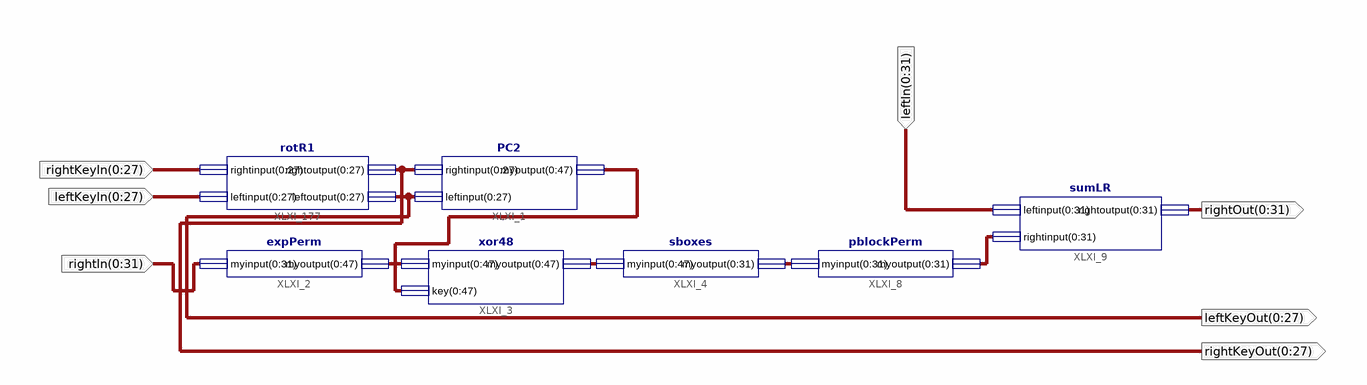
[diagram p0: schematic sheet 1]
// Xilinx ISE schematic decr_roundRot1.sch (spartan3e) as structural Verilog: 7 symbols, 7 ports
module decr_roundRot1 (
  input  [0:31] leftIn,
  input  [0:27] rightKeyIn,
  input  [0:27] leftKeyIn,
  input  [0:31] rightIn,
  output [0:27] leftKeyOut,
  output [0:27] rightKeyOut,
  output [0:31] rightOut
);

  wire [31:0] XLXN_19, XLXN_20;
  wire [47:0] XLXN_12, XLXN_18, XLXN_40;

  PC2 XLXI_1 (
    .rightinput(rightKeyOut), .leftinput(leftKeyOut),
    .myoutput({XLXN_40[0], XLXN_40[1], XLXN_40[2], XLXN_40[3], XLXN_40[4], XLXN_40[5], XLXN_40[6], XLXN_40[7], XLXN_40[8], XLXN_40[9], XLXN_40[10], XLXN_40[11], XLXN_40[12], XLXN_40[13], XLXN_40[14], XLXN_40[15], XLXN_40[16], XLXN_40[17], XLXN_40[18], XLXN_40[19], XLXN_40[20], XLXN_40[21], XLXN_40[22], XLXN_40[23], XLXN_40[24], XLXN_40[25], XLXN_40[26], XLXN_40[27], XLXN_40[28], XLXN_40[29], XLXN_40[30], XLXN_40[31], XLXN_40[32], XLXN_40[33], XLXN_40[34], XLXN_40[35], XLXN_40[36], XLXN_40[37], XLXN_40[38], XLXN_40[39], XLXN_40[40], XLXN_40[41], XLXN_40[42], XLXN_40[43], XLXN_40[44], XLXN_40[45], XLXN_40[46], XLXN_40[47]}));
  expPerm XLXI_2 (
    .myinput(rightIn),
    .myoutput({XLXN_12[0], XLXN_12[1], XLXN_12[2], XLXN_12[3], XLXN_12[4], XLXN_12[5], XLXN_12[6], XLXN_12[7], XLXN_12[8], XLXN_12[9], XLXN_12[10], XLXN_12[11], XLXN_12[12], XLXN_12[13], XLXN_12[14], XLXN_12[15], XLXN_12[16], XLXN_12[17], XLXN_12[18], XLXN_12[19], XLXN_12[20], XLXN_12[21], XLXN_12[22], XLXN_12[23], XLXN_12[24], XLXN_12[25], XLXN_12[26], XLXN_12[27], XLXN_12[28], XLXN_12[29], XLXN_12[30], XLXN_12[31], XLXN_12[32], XLXN_12[33], XLXN_12[34], XLXN_12[35], XLXN_12[36], XLXN_12[37], XLXN_12[38], XLXN_12[39], XLXN_12[40], XLXN_12[41], XLXN_12[42], XLXN_12[43], XLXN_12[44], XLXN_12[45], XLXN_12[46], XLXN_12[47]}));
  xor48 XLXI_3 (
    .myinput({XLXN_12[0], XLXN_12[1], XLXN_12[2], XLXN_12[3], XLXN_12[4], XLXN_12[5], XLXN_12[6], XLXN_12[7], XLXN_12[8], XLXN_12[9], XLXN_12[10], XLXN_12[11], XLXN_12[12], XLXN_12[13], XLXN_12[14], XLXN_12[15], XLXN_12[16], XLXN_12[17], XLXN_12[18], XLXN_12[19], XLXN_12[20], XLXN_12[21], XLXN_12[22], XLXN_12[23], XLXN_12[24], XLXN_12[25], XLXN_12[26], XLXN_12[27], XLXN_12[28], XLXN_12[29], XLXN_12[30], XLXN_12[31], XLXN_12[32], XLXN_12[33], XLXN_12[34], XLXN_12[35], XLXN_12[36], XLXN_12[37], XLXN_12[38], XLXN_12[39], XLXN_12[40], XLXN_12[41], XLXN_12[42], XLXN_12[43], XLXN_12[44], XLXN_12[45], XLXN_12[46], XLXN_12[47]}),
    .key({XLXN_40[0], XLXN_40[1], XLXN_40[2], XLXN_40[3], XLXN_40[4], XLXN_40[5], XLXN_40[6], XLXN_40[7], XLXN_40[8], XLXN_40[9], XLXN_40[10], XLXN_40[11], XLXN_40[12], XLXN_40[13], XLXN_40[14], XLXN_40[15], XLXN_40[16], XLXN_40[17], XLXN_40[18], XLXN_40[19], XLXN_40[20], XLXN_40[21], XLXN_40[22], XLXN_40[23], XLXN_40[24], XLXN_40[25], XLXN_40[26], XLXN_40[27], XLXN_40[28], XLXN_40[29], XLXN_40[30], XLXN_40[31], XLXN_40[32], XLXN_40[33], XLXN_40[34], XLXN_40[35], XLXN_40[36], XLXN_40[37], XLXN_40[38], XLXN_40[39], XLXN_40[40], XLXN_40[41], XLXN_40[42], XLXN_40[43], XLXN_40[44], XLXN_40[45], XLXN_40[46], XLXN_40[47]}),
    .myoutput({XLXN_18[0], XLXN_18[1], XLXN_18[2], XLXN_18[3], XLXN_18[4], XLXN_18[5], XLXN_18[6], XLXN_18[7], XLXN_18[8], XLXN_18[9], XLXN_18[10], XLXN_18[11], XLXN_18[12], XLXN_18[13], XLXN_18[14], XLXN_18[15], XLXN_18[16], XLXN_18[17], XLXN_18[18], XLXN_18[19], XLXN_18[20], XLXN_18[21], XLXN_18[22], XLXN_18[23], XLXN_18[24], XLXN_18[25], XLXN_18[26], XLXN_18[27], XLXN_18[28], XLXN_18[29], XLXN_18[30], XLXN_18[31], XLXN_18[32], XLXN_18[33], XLXN_18[34], XLXN_18[35], XLXN_18[36], XLXN_18[37], XLXN_18[38], XLXN_18[39], XLXN_18[40], XLXN_18[41], XLXN_18[42], XLXN_18[43], XLXN_18[44], XLXN_18[45], XLXN_18[46], XLXN_18[47]}));
  sboxes XLXI_4 (
    .myinput({XLXN_18[0], XLXN_18[1], XLXN_18[2], XLXN_18[3], XLXN_18[4], XLXN_18[5], XLXN_18[6], XLXN_18[7], XLXN_18[8], XLXN_18[9], XLXN_18[10], XLXN_18[11], XLXN_18[12], XLXN_18[13], XLXN_18[14], XLXN_18[15], XLXN_18[16], XLXN_18[17], XLXN_18[18], XLXN_18[19], XLXN_18[20], XLXN_18[21], XLXN_18[22], XLXN_18[23], XLXN_18[24], XLXN_18[25], XLXN_18[26], XLXN_18[27], XLXN_18[28], XLXN_18[29], XLXN_18[30], XLXN_18[31], XLXN_18[32], XLXN_18[33], XLXN_18[34], XLXN_18[35], XLXN_18[36], XLXN_18[37], XLXN_18[38], XLXN_18[39], XLXN_18[40], XLXN_18[41], XLXN_18[42], XLXN_18[43], XLXN_18[44], XLXN_18[45], XLXN_18[46], XLXN_18[47]}),
    .myoutput({XLXN_19[0], XLXN_19[1], XLXN_19[2], XLXN_19[3], XLXN_19[4], XLXN_19[5], XLXN_19[6], XLXN_19[7], XLXN_19[8], XLXN_19[9], XLXN_19[10], XLXN_19[11], XLXN_19[12], XLXN_19[13], XLXN_19[14], XLXN_19[15], XLXN_19[16], XLXN_19[17], XLXN_19[18], XLXN_19[19], XLXN_19[20], XLXN_19[21], XLXN_19[22], XLXN_19[23], XLXN_19[24], XLXN_19[25], XLXN_19[26], XLXN_19[27], XLXN_19[28], XLXN_19[29], XLXN_19[30], XLXN_19[31]}));
  pblockPerm XLXI_8 (
    .myinput({XLXN_19[0], XLXN_19[1], XLXN_19[2], XLXN_19[3], XLXN_19[4], XLXN_19[5], XLXN_19[6], XLXN_19[7], XLXN_19[8], XLXN_19[9], XLXN_19[10], XLXN_19[11], XLXN_19[12], XLXN_19[13], XLXN_19[14], XLXN_19[15], XLXN_19[16], XLXN_19[17], XLXN_19[18], XLXN_19[19], XLXN_19[20], XLXN_19[21], XLXN_19[22], XLXN_19[23], XLXN_19[24], XLXN_19[25], XLXN_19[26], XLXN_19[27], XLXN_19[28], XLXN_19[29], XLXN_19[30], XLXN_19[31]}),
    .myoutput({XLXN_20[0], XLXN_20[1], XLXN_20[2], XLXN_20[3], XLXN_20[4], XLXN_20[5], XLXN_20[6], XLXN_20[7], XLXN_20[8], XLXN_20[9], XLXN_20[10], XLXN_20[11], XLXN_20[12], XLXN_20[13], XLXN_20[14], XLXN_20[15], XLXN_20[16], XLXN_20[17], XLXN_20[18], XLXN_20[19], XLXN_20[20], XLXN_20[21], XLXN_20[22], XLXN_20[23], XLXN_20[24], XLXN_20[25], XLXN_20[26], XLXN_20[27], XLXN_20[28], XLXN_20[29], XLXN_20[30], XLXN_20[31]}));
  sumLR XLXI_9 (
    .leftinput(leftIn),
    .rightinput({XLXN_20[0], XLXN_20[1], XLXN_20[2], XLXN_20[3], XLXN_20[4], XLXN_20[5], XLXN_20[6], XLXN_20[7], XLXN_20[8], XLXN_20[9], XLXN_20[10], XLXN_20[11], XLXN_20[12], XLXN_20[13], XLXN_20[14], XLXN_20[15], XLXN_20[16], XLXN_20[17], XLXN_20[18], XLXN_20[19], XLXN_20[20], XLXN_20[21], XLXN_20[22], XLXN_20[23], XLXN_20[24], XLXN_20[25], XLXN_20[26], XLXN_20[27], XLXN_20[28], XLXN_20[29], XLXN_20[30], XLXN_20[31]}),
    .rightoutput(rightOut));
  rotR1 XLXI_177 (.rightinput(rightKeyIn), .leftinput(leftKeyIn), .rightoutput(rightKeyOut), .leftoutput(leftKeyOut));
endmodule
